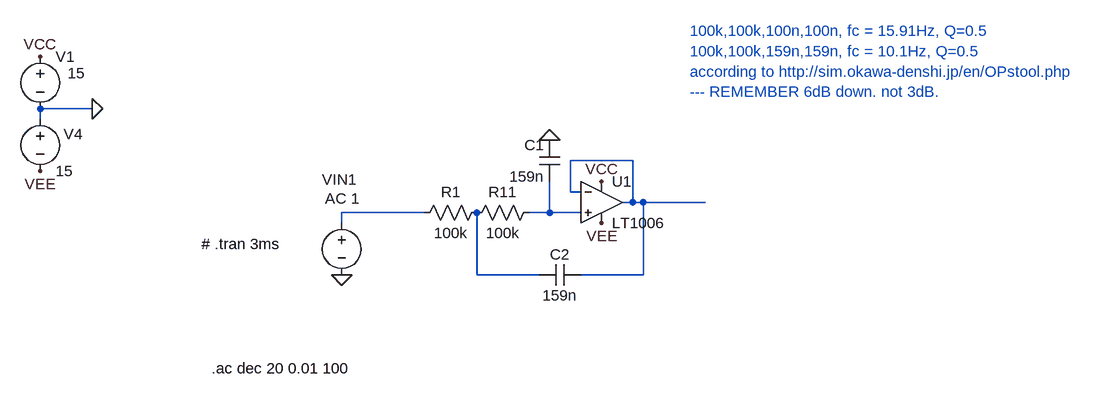
[diagram p0: schematic Draft01.asc]
Draft01.asc, the LTspice schematic file:
Version 4
SHEET 1 2756 2104
WIRE -672 -544 -752 -544
WIRE -752 -528 -752 -544
WIRE 160 -464 64 -464
WIRE 64 -416 64 -464
WIRE 80 -416 64 -416
WIRE 160 -400 160 -464
WIRE 160 -400 144 -400
WIRE 176 -400 160 -400
WIRE 272 -400 176 -400
WIRE -160 -384 -288 -384
WIRE 32 -384 32 -432
WIRE 32 -384 0 -384
WIRE 80 -384 32 -384
WIRE -288 -368 -288 -384
WIRE -80 -288 -80 -384
WIRE 16 -288 -80 -288
WIRE 176 -288 176 -400
WIRE 176 -288 80 -288
FLAG -752 -624 VCC
FLAG -752 -448 VEE
FLAG 112 -432 VCC
FLAG 112 -368 VEE
FLAG -672 -544 0
FLAG 32 -496 0
FLAG -288 -288 0
SYMBOL voltage -752 -640 R0
WINDOW 123 0 0 Left 0
WINDOW 39 0 0 Left 0
WINDOW 3 42 41 Left 2
SYMATTR Value 15
SYMATTR InstName V1
SYMBOL voltage -752 -544 R0
WINDOW 123 0 0 Left 0
WINDOW 39 0 0 Left 0
WINDOW 0 36 39 Left 2
SYMATTR InstName V4
SYMATTR Value 15
SYMBOL res -96 -368 R270
WINDOW 0 32 56 VTop 2
WINDOW 3 0 56 VBottom 2
SYMATTR InstName R11
SYMATTR Value 100k
SYMBOL OpAmps\\LT1006 112 -464 R0
SYMATTR InstName U1
SYMBOL res -176 -368 R270
WINDOW 0 32 56 VTop 2
WINDOW 3 0 56 VBottom 2
SYMATTR InstName R1
SYMATTR Value 100k
SYMBOL cap 80 -304 R90
WINDOW 0 0 32 VBottom 2
WINDOW 3 32 32 VTop 2
SYMATTR InstName C2
SYMATTR Value 159n
SYMBOL cap 48 -432 R180
WINDOW 0 24 56 Left 2
WINDOW 3 24 8 Left 2
SYMATTR InstName C1
SYMATTR Value 159n
SYMBOL voltage -288 -384 R0
WINDOW 123 -26 -22 Left 2
WINDOW 39 0 0 Left 0
WINDOW 3 -341 151 Left 2
WINDOW 0 -30 -51 Left 2
SYMATTR Value2 AC 1
SYMATTR Value ""
SYMATTR InstName VIN1
TEXT -504 -336 Left 2 !# .tran 3ms
TEXT -488 -144 Left 2 !.ac dec 20 0.01 100
TEXT 248 -664 Left 2 ;100k,100k,100n,100n, fc = 15.91Hz, Q=0.5\n100k,100k,159n,159n, fc = 10.1Hz, Q=0.5\naccording to http://sim.okawa-denshi.jp/en/OPstool.php\n--- REMEMBER 6dB down. not 3dB.

The netlist it stands for:
* Draft01.asc
V1 VCC 0 15
V4 0 VEE 15
R11 N004 N003 100k
XU1 N003 N001 VCC VEE N001 LT1006  ; pins In+ In- V+ V- OUT
R1 N002 N004 100k
C2 N001 N004 159n
C1 N003 0 159n
VIN1 N002 0 AC 1
# .tran 3ms
.ac dec 20 0.01 100
* 100k,100k,100n,100n, fc = 15.91Hz, Q=0.5
* 100k,100k,159n,159n, fc = 10.1Hz, Q=0.5
* according to http://sim.okawa-denshi.jp/en/OPstool.php
* --- REMEMBER 6dB down. not 3dB.
.lib LTC.lib
.backanno
.end